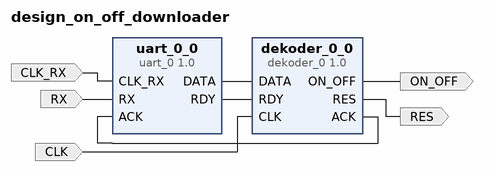
[diagram p0: block diagram of the top level]
# Vivado block design design_on_off_downloader, xc7z020clg400-2, Vivado 2019.1
create_bd_design design_on_off_downloader

create_bd_port -dir I -type clk CLK
create_bd_port -dir I CLK_RX
create_bd_port -dir I RX
create_bd_port -dir O RES
create_bd_port -dir O ON_OFF

create_bd_cell -type ip -vlnv xilinx.com:user:uart_0:1.0 uart_0_0
create_bd_cell -type ip -vlnv xilinx.com:user:dekoder_0:1.0 dekoder_0_0

# ---- connections ----

connect_bd_net [get_bd_pins uart_0_0/DATA] [get_bd_pins dekoder_0_0/DATA]
connect_bd_net [get_bd_pins uart_0_0/RDY] [get_bd_pins dekoder_0_0/RDY]
connect_bd_net -net CLK_0_1 [get_bd_ports CLK] [get_bd_pins dekoder_0_0/CLK]
connect_bd_net -net CLK_RX_0_1 [get_bd_ports CLK_RX] [get_bd_pins uart_0_0/CLK_RX]
connect_bd_net -net RX_0_1 [get_bd_ports RX] [get_bd_pins uart_0_0/RX]
connect_bd_net [get_bd_pins dekoder_0_0/ACK] [get_bd_pins uart_0_0/ACK]
connect_bd_net [get_bd_pins dekoder_0_0/RES] [get_bd_ports RES]
connect_bd_net [get_bd_pins dekoder_0_0/ON_OFF] [get_bd_ports ON_OFF]

validate_bd_design
save_bd_design
